# EAGLE design double-tube-base (EAGLE 6.6.0)
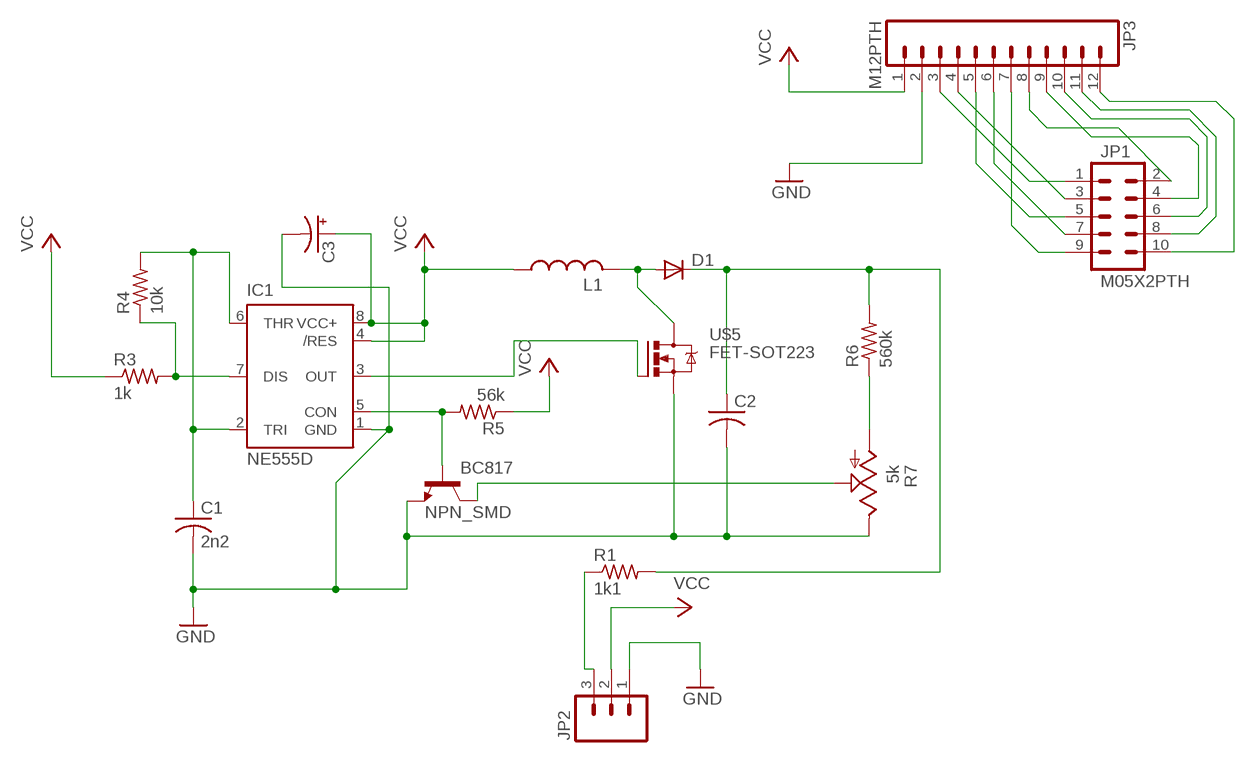
[diagram p0: schematic, sheet 1]

## Parts
BC817  NPN_SMD  [SOT-23]
C1  2n2  CAPACITORC0603K  [C0603K]
C2  CAPACITORC1812K  [C1812K]
C3  CAPACITOR_POLSMCD  [SMC_D]
D1  DIODESMA  [SMA-DIODE]
IC1  NE555D  [SO08]
JP1  M05X2PTH  [AVR_ICSP]
JP2  M03PTH  [1X03]
JP3  M12PTH  [1X12]
L1  INDUCTORSMD-10MM  [SMD-10MM]
R1  1k1  RESISTORR1206  [R1206]
R3  1k  RESISTORR0603  [R0603]
R4  10k  RESISTORR0603  [R0603]
R5  56k  RESISTORR0603  [R0603]
R6  560k  RESISTORR1206  [R1206]
R7  5k  TRIM_POTEVM2N  [TRIM-EVM2N]
U$5  FET-SOT223  [SOT-223]

## Nets
GND: BC817.2(E) C1.2 C2.2 C3.- IC1.1(GND) JP2.1 JP3.2 R7.P$3(E) U$5.3(S)
N$1: IC1.7(DIS) R3.2 R4.1
N$2: C1.1 IC1.2(TRI) IC1.6(THR) R4.2
N$3: BC817.1(B) IC1.5(CON) R5.2
N$4: D1.A L1.P$2 U$5.2(D) U$5.4(D)
N$5: C2.1 D1.C R1.2 R6.2
N$6: BC817.3(C) R7.P$2(S)
N$7: R6.1 R7.P$1(A)
N$8: IC1.3(OUT) U$5.1(G)
N$9: JP2.3 R1.1
N$11: JP1.1 JP3.3
N$12: JP1.3 JP3.4
N$13: JP1.5 JP3.5
N$14: JP1.7 JP3.6
N$15: JP1.9 JP3.7
N$16: JP1.2 JP3.8
N$17: JP1.4 JP3.9
N$18: JP1.6 JP3.10
N$19: JP1.8 JP3.11
N$20: JP1.10 JP3.12
VCC: C3.+ IC1.4(/RES) IC1.8(VCC+) JP2.2 JP3.1 L1.P$1 R3.1 R5.1

## Library data of the parts
BC817 = iStivi - Transistor-FET-reg:NPN_SMD: NPN Transistor NPN transistor with smd package BC817 PMBTA42
C1 C2 = iStivi - RCLD:CAPACITOR: CAPACITOR, American symbol
C3 = iStivi - RCLD:CAPACITOR_POL: POLARIZED CAPACITOR, American symbol
D1 = iStivi - RCLD:DIODE: Diode These are standard reverse protection diodes and small signal diodes.
IC1 = iStivi - ICs:NE555: Timer General purpose bipolar Timer
JP1 = iStivi - Header-Connector:M05X2: Header 5x2 Standard 10-pin dual row 0.1" header. Commonly used with AVR-ISP. Use with Spark Fun Electronics SKU: PRT-00778
JP2 = iStivi - Header-Connector:M03: Header 3 Standard 3-pin 0.1" header. Use with straight break away headers (SKU : PRT-00116), right angle break away headers (PRT-00553), swiss pins (PRT-00743), machine pins (PRT-00117), and female headers (PRT-00115). Molex polarized connector foot print use with SKU : PRT-08232 with associated crimp pins and housings.
JP3 = iStivi - Header-Connector:M12: Header 12 Standard 12-pin 0.1" header. Use with straight break away headers (SKU : PRT-00116), right angle break away headers (PRT-00553), swiss pins (PRT-00743), machine pins (PRT-00117), and female headers (PRT-00115).
L1 = iStivi - RCLD:INDUCTOR: INDUCTOR
R1 R3-R6 = iStivi - RCLD:RESISTOR: RESISTOR
R7 = iStivi - RCLD:TRIM_POT: POTENTIOMETER
U$5 = iStivi - Transistor-FET-reg:FET-SOT223: FET in SOT-223 case N-channel MOSFET BSP324

## Board
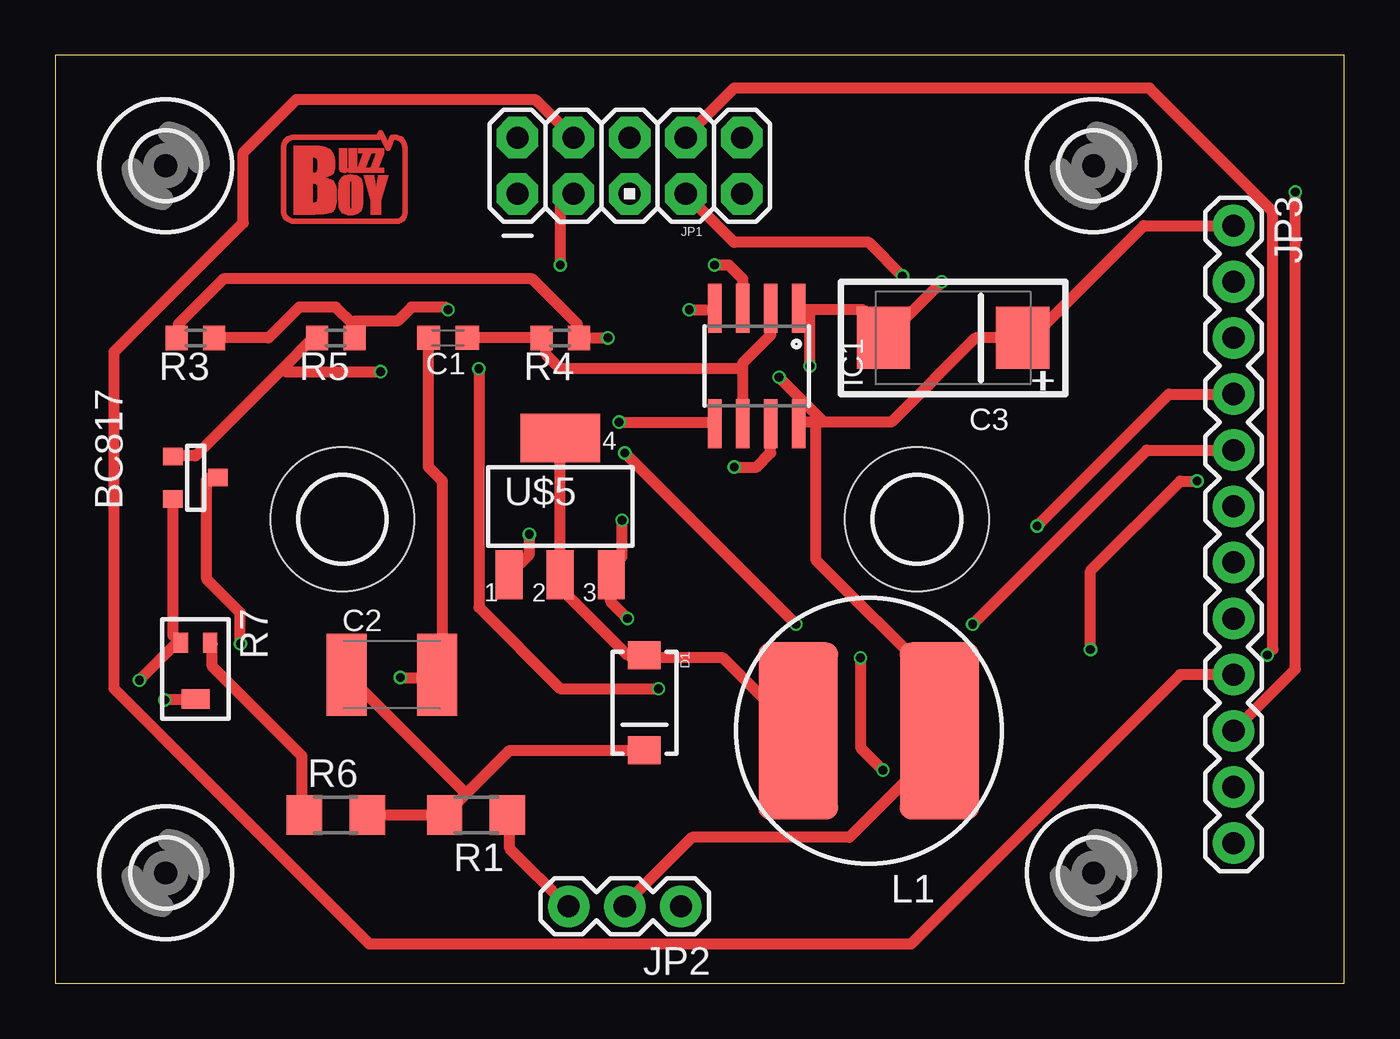
[diagram p1: board, top side]
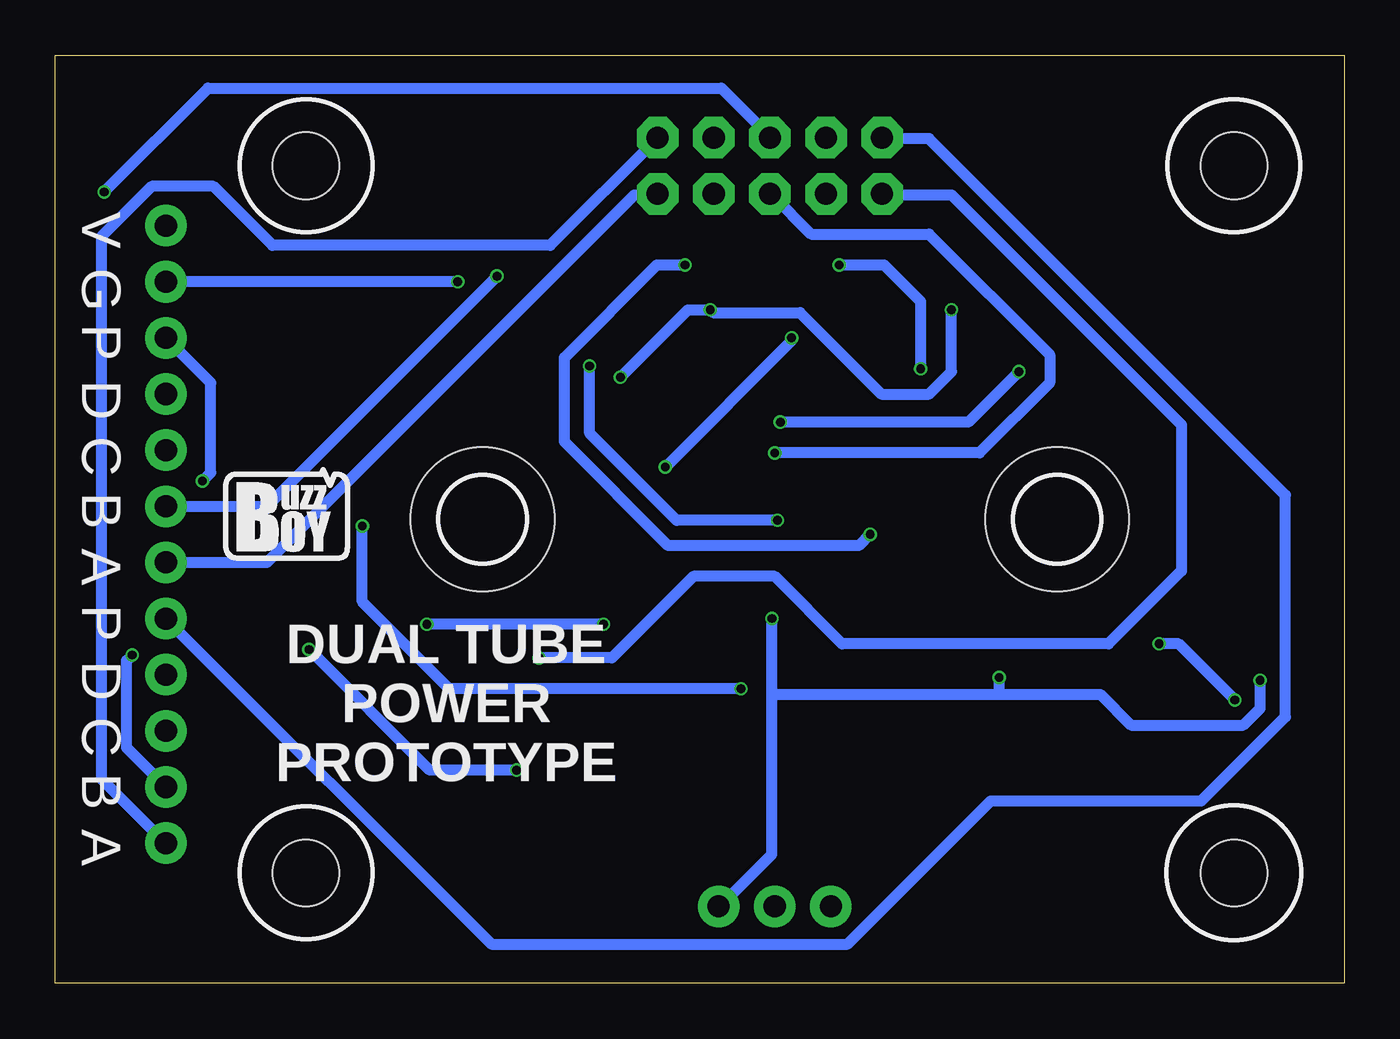
[diagram p2: board, bottom side, seen from below]

Size 58.35 x 42 mm. Coordinates in mm from the lower left corner, seen from the top.
Outline: 0,0 58.35,0 58.35,42 0,42 0,0
Copper layers (1*16): Top 0.035mm / dielectric 1.5mm / Bottom 0.035mm
Design rules "doubletube *": minimum track width 20mil, minimum drill 0.4mm, track to track 20mil, track to pad 20mil, pad to pad 8mil, via to via 8mil, smd to smd 8mil, copper to edge 40mil, drill to drill 8mil, minimum pad ring 10mil, minimum via ring 4mil, stop-mask expansion 4mil, vias tented up to drill 0.5mm, thermal gap 10mil
Holes 6.5 mm at 13,21 39,21

### Footprints (pad centres in the part's own frame; a part is rotated, then mirrored left to right if it is on the bottom)
SOT-23 = smd 0.787 x 0.889: 1 0.991,1.016; 2 -0.94,1.016; 3 0.025,-1.016
C0603K = smd 1.05 x 1.08: 1 -0.875,0; 2 0.875,0
C1812K = smd 1.8 x 3.7: 1 -2.05,0; 2 2.05,0
SMC_D = smd 2.4 x 2.8: + -3.15,0; - 3.15,0
SMA-DIODE = smd 1.27 x 1.47: A -2.15,0; C 2.15,0
SO08 = smd 0.61 x 2.21: 1 -1.905,-2.616; 2 -0.635,-2.616; 3 0.635,-2.616; 4 1.905,-2.616; 5 1.905,2.616; 6 0.635,2.616; 7 -0.635,2.616; 8 -1.905,2.616
AVR_ICSP = drill 1 pad 1.88 octagon: 1 -1.27,5.08; 2 1.27,5.08; 3 -1.27,2.54; 4 1.27,2.54; 5 -1.27,0; 6 1.27,0; 7 -1.27,-2.54; 8 1.27,-2.54; 9 -1.27,-5.08; 10 1.27,-5.08
1X03 = drill 1 pad 1.88: 1 0,0; 2 2.54,0; 3 5.08,0
1X12 = drill 1 pad 1.88: 1 0,0; 2 2.54,0; 3 5.08,0; 4 7.62,0; 5 10.16,0; 6 12.7,0; 7 15.24,0; 8 17.78,0; 9 20.32,0; 10 22.86,0; 11 25.4,0; 12 27.94,0
SMD-10MM = smd 3.6 x 8: P$1 -3.2,0; P$2 3.2,0
R1206 = smd 1.6 x 1.803: 1 -1.422,0; 2 1.422,0
R0603 = smd 1 x 1.1: 1 -0.85,0; 2 0.85,0
TRIM-EVM2N = smd 0.635 x 0.9: P$1 -0.66,-1.45; P$3 0.66,-1.45 | smd 1.27 x 0.9: P$2 0,1.1
3,0-SMALL = hole 3: 0,0
SOT-223 = smd 1.219 x 2.235: 1 -2.311,-3.099; 2 0,-3.099; 3 2.311,-3.099 | smd 3.6 x 2.2: 4 0,3.099

### Placement (x,y rotation side)
BC817  6.35,22.86 90 top
C1  17.78,29.21 180 top
C2  15.24,13.97 0 top
C3  40.64,29.21 180 top
D1  26.67,12.7 270 top
IC1  31.75,27.94 180 top
JP1  26,37 90 top
JP2  28.32,3.49 180 top
JP3  53.34,34.29 270 top
L1  36.83,11.43 180 top
R1  19.05,7.62 180 top
R3  6.35,29.21 180 top
R4  22.86,29.21 180 top
R5  12.7,29.21 180 top
R6  12.7,7.62 0 top
R7  6.35,13.97 180 top
U$1  [3,0-SMALL]  5,5 0 top
U$2  [3,0-SMALL]  5,37 0 top
U$3  [3,0-SMALL]  47,37 0 top
U$4  [3,0-SMALL]  47,5 0 top
U$5  22.86,21.59 0 top
U$6  [BUZZBOY]  10.16,34.29 0 top
U$7  [BUZZBOY-SILK-BOTTOM]  48.26,21.59 0 bottom

### Tracks (layer width: path | path; a pad name or v marks a point on that pad's centre or on a via)
GND  (via drill 0.4)
  Top 0.508: 34.16,30.48 36.58,30.48 37.47,29.59 37.47,29.21 C3.- 37.72,29.34 v40.13,31.75 | 34.16,30.48 33.66,30.48 IC1.1 | C1.2 16.89,29.21 16.89,23.37 17.53,22.73 17.53,14.61 17.27,14.35 17.27,13.97 C2.2 17.14,13.84 v15.62,13.84 | BC817.2 5.33,15.75 5.59,15.49 R7.P$3 5.46,15.37 v3.81,13.72 | v25.91,16.51 25.15,17.27 25.15,18.41 U$5.3 25.02,18.67 25.65,19.3 v25.65,20.95 | v34.16,27.94 34.16,30.48
  Bottom 0.508: v40.13,31.75 JP3.2 | 25.91,13.08 25.91,5.84 28.19,3.56 JP2.1 | 25.91,13.08 v25.91,16.51 | v3.81,13.72 3.81,12.45 4.57,11.68 9.65,11.68 11.05,13.08 15.62,13.08 | 25.91,13.08 15.62,13.08 | 15.62,13.08 v15.62,13.84 | v34.16,27.94 34.16,24.89 30.23,20.95 v25.65,20.95
N$1  (via drill 0.4)
  Top 0.508: R3.2 5.59,29.21 5.59,29.84 7.62,31.88 21.59,31.88 23.62,29.84 23.62,29.21 R4.1 v25.02,29.21 | IC1.7 32.38,24 31.75,23.37 v30.73,23.37
  Bottom 0.508: v30.73,23.37 25.02,29.08 v25.02,29.21
N$2
  Top 0.508: C1.1 R4.2 22.23,29.08 22.23,28.45 22.86,27.81 31.11,27.81 | 31.11,27.81 31.11,28.07 32.38,29.34 IC1.2 | 31.11,27.81 IC1.6
N$3  (via drill 0.4)
  Top 0.508: 10.29,27.81 11.68,29.21 R5.2 | 10.29,27.81 6.35,23.88 5.33,23.88 BC817.1 | v25.53,25.4 29.84,25.4 IC1.5 | v14.73,27.69 10.41,27.69 10.29,27.81
  Bottom 0.508: v25.53,25.4 17.02,25.4 v14.73,27.69
N$4
  Top 0.508: U$5.4 U$5.2 22.86,17.91 25.91,14.86 D1.A 26.8,14.73 30.23,14.73 33.53,11.43 L1.P$2
N$5
  Top 0.508: 18.61,8.57 17.65,7.62 R1.2 R6.2 | 18.61,8.57 20.57,10.54 D1.C | 18.61,8.57 13.21,13.97 C2.1
N$6  (via drill 0.4)
  Top 0.508: v8.38,15.37 8.38,16.76 6.86,18.29 6.86,22.86 7.37,22.86 BC817.3 | v4.95,12.83 6.35,12.83 R7.P$2
  Bottom 0.508: v8.38,15.37 7.49,15.37 v4.95,12.83
N$7
  Top 0.508: R7.P$1 7.11,15.37 7.11,14.35 11.18,10.29 11.18,7.62 R6.1
N$8  (via drill 0.4)
  Top 0.508: IC1.3 31.11,31.88 30.48,32.51 v29.84,32.51 | v21.46,20.32 21.46,19.43 20.57,18.54 U$5.1
  Bottom 0.508: v29.84,32.51 31.11,32.51 35.31,28.32 35.31,24.51 30.61,19.81 21.97,19.81 v21.46,20.32
N$9
  Top 0.508: R1.1 20.57,7.62 20.57,6.1 23.11,3.56 JP2.3
N$11  (via drill 0.4)
  Top 0.508: v51.69,22.73 50.93,22.73 46.86,18.67 v46.86,15.11 | v37.47,9.65 36.45,10.67 v36.45,14.73
  Bottom 0.508: JP3.3 51.31,27.18 51.31,23.11 v51.69,22.73 | v46.86,15.11 41.4,9.65 v37.47,9.65 | v36.45,14.73 33.15,14.73 29.46,18.41 25.78,18.41 22.73,15.37 10.67,15.37 7.37,18.67 7.37,25.27 17.78,35.69 20.83,35.69 JP1.1
N$12  (via drill 0.4)
  Top 0.508: JP3.4 50.42,26.67 v44.45,20.7 | v27.3,13.34 22.86,13.34 19.18,17.02 v19.18,27.81 | v22.86,32.51 22.86,35.18 23.37,35.69 JP1.3
  Bottom 0.508: v44.45,20.7 44.45,17.27 40.51,13.34 v27.3,13.34 | v19.18,27.81 19.18,30.86 20.83,32.51 v22.86,32.51
N$13  (via drill 0.4)
  Top 0.508: JP3.5 49.4,24.13 v41.53,16.26 | v25.78,24 v33.53,16.26
  Bottom 0.508: v33.53,16.26 v41.53,16.26 | v25.78,24 16.51,24 13.34,27.18 13.34,28.45 18.8,33.91 24.13,33.91 25.91,35.69 JP1.5
N$14  (via drill 0.4)
  Top 0.508: v38.35,32 36.83,33.53 30.73,33.53 28.57,35.69 JP1.7
  Bottom 0.508: v38.35,32 48.77,21.59 JP3.6
N$15
  Bottom 0.508: JP3.7 48.77,19.05 32.13,35.69 31.11,35.69 JP1.9
N$16
  Bottom 0.508: JP3.8 38.61,1.78 22.48,1.78 16,8.26 6.48,8.26 2.67,12.06 2.67,22.1 18.8,38.23 20.83,38.23 JP1.2
N$17
  Top 0.508: JP3.9 50.93,13.97 38.73,1.78 14.22,1.78 2.67,13.34 2.67,28.57 8.51,34.42 8.51,37.59 10.92,40.01 21.72,40.01 23.37,38.35 JP1.4
N$18  (via drill 0.4)
  Top 0.508: v56.13,35.81 56.13,14.22 JP3.10
  Bottom 0.508: v56.13,35.81 51.44,40.51 28.19,40.51 26.04,38.35 JP1.6
N$19  (via drill 0.4)
  Top 0.508: v54.86,14.86 55.12,15.11 55.12,34.92 49.53,40.51 30.73,40.51 28.57,38.35 JP1.8
  Bottom 0.508: v54.86,14.86 55.12,14.61 55.12,10.67 JP3.11
N$20
  Bottom 0.508: JP3.12 56.26,9.27 56.26,33.78 53.98,36.07 51.18,36.07 48.51,33.4 35.94,33.4 31.11,38.23 JP1.10
VCC  (via drill 0.4)
  Top 0.508: JP2.2 25.78,3.56 28.83,6.6 35.94,6.6 40.01,10.67 40.01,11.43 L1.P$1 39.88,11.56 39.88,13.72 34.42,19.18 34.42,25.4 | R3.1 9.65,29.21 11.05,30.61 12.7,30.61 13.46,29.84 | 13.46,29.84 13.46,29.21 R5.1 | 34.67,25.4 37.85,25.4 41.66,29.21 C3.+ 43.94,29.34 44.32,29.34 49.28,34.29 JP3.1 | 34.67,25.4 34.42,25.4 | 34.42,25.4 33.66,25.4 IC1.8 | v28.7,30.48 29.84,30.48 IC1.4 | v32.77,27.43 34.67,25.53 34.67,25.4 | v17.78,30.48 17.65,30.61 16.13,30.61 15.49,29.97 13.59,29.97 13.46,29.84
  Bottom 0.508: v32.77,27.43 29.72,30.48 v28.7,30.48 28.57,30.35 24.64,30.35 20.95,26.67 18.8,26.67 17.78,27.69 v17.78,30.48

### Text on the board
_tplace: +
_bplace: V | G | P | D | C | B | A | P | D | DUAL TUBE / POWER / PROTOTYPE | C | B | A